# Altium project ld_monitoring_decoupling.PrjPcb
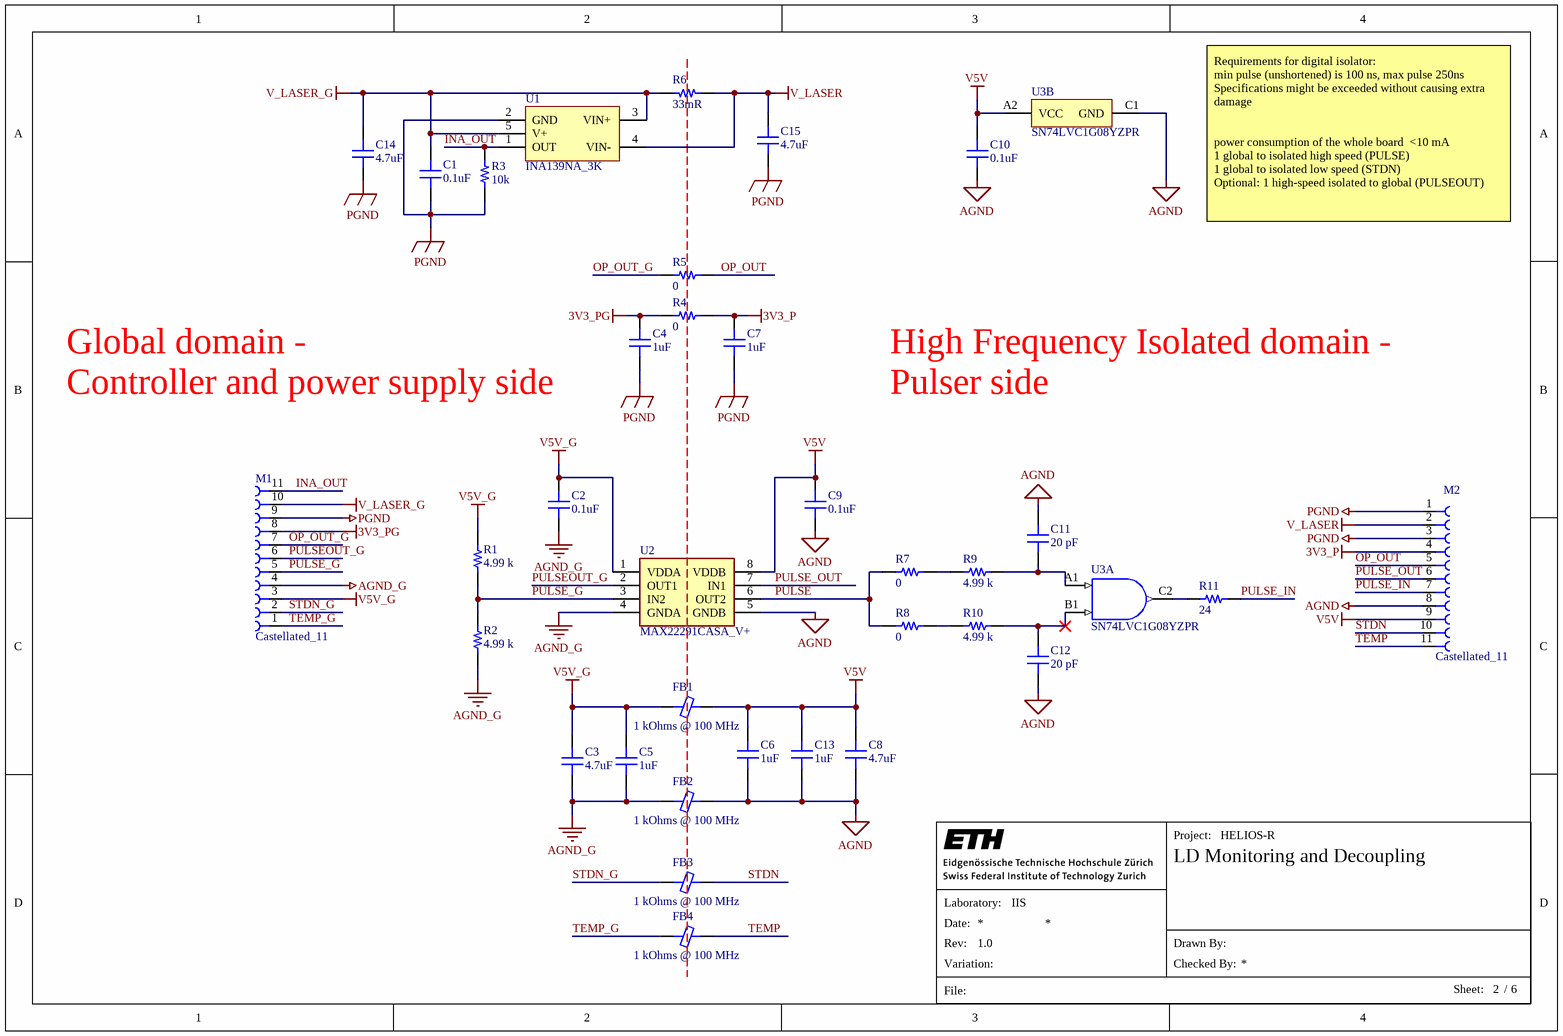
[diagram p0: ld_monitoring_decoupling.SchDoc]
Author: villanif; DrawnBy: =Author; LAB: IIS; Laboratory: =LAB; ProjectTitle: HELIOS-R; Revision: 1.0
1 sheet, 36 parts. Net scope: global (net labels, ports and power ports of the same name join across sheets).
Board files: ld_monitoring_decoupling.PcbDoc, LD_panel_monitoring_module.PcbDoc

## Sheet ld_monitoring_decoupling.SchDoc: LD Monitoring and Decoupling
size A4; Organization: IIS; SheetNumber: 2; SheetTotal: 6; FileInfo: ld_monitoring_decoupling.SchDoc

### Parts
(Parts that share a designator on the sheet are numbered #1, #2 ... from top to bottom, then left to right.)
C1  0.1uF  [CAP 0201_0603]
C2  0.1uF  [CAP 0201_0603]
C3  4.7uF  [CAP 0805_2012]
C4  1uF  [FP-LLL152-0_2-MFG]
C5  1uF  [FP-LLL152-0_2-MFG]
C6  1uF  [FP-LLL152-0_2-MFG]
C7  1uF  [FP-LLL152-0_2-MFG]
C8  4.7uF  [CAP 0805_2012]
C9  0.1uF  [CAP 0201_0603]
C10  0.1uF  [CAP 0201_0603]
C11  20 pF  [CAP 0402_1005]
C12  20 pF  [CAP 0402_1005]
C13  1uF  [FP-LLL152-0_2-MFG]
C14  4.7uF  [CAP 0805_2012]
C15  4.7uF  [CAP 0805_2012]
FB1  1 kOhms @ 100 MHz  [FER 0603_1608]
FB2  1 kOhms @ 100 MHz  [FER 0603_1608]
FB3  1 kOhms @ 100 MHz  [FER 0603_1608]
FB4  1 kOhms @ 100 MHz  [FER 0603_1608]
M1  Castellated_11  [Castellated_]  (no BOM)
M2  Castellated_11  [Castellated_]  (no BOM)
R1  4.99 k  [RES 0402_1005]
R2  4.99 k  [RES 0402_1005]
R3  10k  [RES 0402_1005]
R4  0  [RES 0201_0603]
R5  0  [RES 0201_0603]
R6  33mR  [STACKPOLE CSR0603]
R7  0  [RES 0402_1005]
R8  0  [RES 0402_1005]
R9  4.99 k  [RES 0201_0603]
R10  4.99 k  [RES 0201_0603]
R11  24  [RES 0201_0603]
U1  INA139NA_3K  [SOT95P280X145-5N]
U2  MAX22291CASA_V+  [SOIC127P600X175-8N]
U3#1  SN74LVC1G08YZPR  [YZP0005ADAD]  (part B of 2)
U3#2  SN74LVC1G08YZPR  [YZP0005ADAD]  (part A of 2)

### Nets
3V3_P: C7.2 M2.4 R4.2
3V3_PG: C4.2 M1.8 R4.1
AGND: C6.1 C8.1 C9.1 C10.1 C11.1 C12.1 C13.1 FB2.2 M2.8 U2.5(GNDB) U3#1.C1(GND)
AGND_G: C2.2 C3.1 C5.1 FB2.1 M1.4 R2.1 U2.4(GNDA)
PGND: C1.2 C4.1 C7.1 C14.1 C15.1 M1.9 M2.1 M2.3 R3.1 U1.2(GND)
V5V: C6.2 C8.2 C9.2 C10.2 C13.2 FB1.2 M2.9 U2.8(VDDB) U3#1.A2(VCC)
V5V_G: C2.1 C3.2 C5.2 FB1.1 M1.3 R1.2 U2.1(VDDA)
V_LASER: C15.2 M2.2 R6.1 U1.4(VIN-)
V_LASER_G: C1.1 C14.2 M1.10 R6.2 U1.3(VIN+) U1.5(V+)
INA_OUT: M1.11 R3.2 U1.1(OUT)
OP_OUT: M2.5 R5.2
OP_OUT_G: M1.7 R5.1
PULSE: R7.1 R8.1 U2.6(OUT2)
PULSE_G: M1.5 R1.1 R2.2 U2.3(IN2)
PULSE_IN: M2.7 R11.2
PULSE_OUT: M2.6 U2.7(IN1)
PULSEOUT_G: M1.6 U2.2(OUT1)
STDN: FB3.2 M2.10
STDN_G: FB3.1 M1.2
TEMP: FB4.2 M2.11
TEMP_G: FB4.1 M1.1
NetC11_2: C11.2 R9.2 U3#2.A1(A)
NetC12_2: C12.2 R10.2 U3#2.B1(B)
NetR7_2: R7.2 R9.1
NetR8_2: R8.2 R10.1
NetR11_1: R11.1 U3#2.C2(Y)

### Notes on the sheet
- Requirements for digital isolator:
  min pulse (unshortened) is 100 ns, max pulse 250ns
  Specifications might be exceeded without causing extra damage
  power consumption of the whole board  <10 mA
  1 global to isolated high speed (PULSE)
  1 global to isolated low speed (STDN)
  Optional: 1 high-speed isolated to global (PULSEOUT)
- Global domain -
- High Frequency Isolated domain -
- (near C4) Controller and power supply side
- Pulser side
- Project:
- Laboratory:
- Date:
- File:
- Rev:
- Variation:
- Drawn By:
- Checked By:
- Sheet:
- /

### Library data of the parts
C1 C2 C9 C10 = GRM033R6YA104ME14D: CAP CER 0.1UF 35V X5R 0201; manufacturer: Murata Electronics; Capacitance: 0.1 µF; Tolerance: ±20%; Part Number: GRM033R6YA104ME14D; Applications: General Purpose; componentlink1description: Datasheet; componentlink1url: https://search.murata.co.jp/Ceramy/image/img/A01X/G101/ENG/GRM033R6YA104ME14-01.pdf; componentlink2description: DigiKey Link; componentlink2url: https://www.digikey.com/en/products/detail/murata-electronics/GRM033R6YA104ME14D/5027516; Device Package: 0201 (0603 Metric); lastupdated: 15/07/2023 19:00:56; Lifecycle Status: Active; Minimum Order: 1; Mounting Type: Surface Mount; Operating Temperature: -55°C ~ 85°C; Package / Case: 0201 (0603 Metric); packaging: CutTape; partid: 17; Part Status: Active; price: 0.01; series: GRM; Size / Dimension: 0.024" L x 0.012" W (0.60mm x 0.30mm); Supplier 1: Digi-Key; Supplier Part Number 1: 490-10431-1-ND; Temperature Coefficient: X5R; Thickness (Max): 0.013" (0.33mm); Voltage - Rated: 35V; Value: 0.1uF; Supplier 2: Mouser; Supplier Part Number 2: 81-GRM33R6YA104ME14D
C3 C8 C14 C15 = GRM21BC81H475KE11L: CAP CER 4.7UF 50V X6S 0805; Manufacturer: Murata; Dielectric Material: Ceramic; Tolerance  (fill in as +-): 10%; Multilayer: Yes; Supplier: Mouser; Supplier Part Number: 81-GRM21BC81H475KE1L; Manufacturer Part Number: GRM21BC81H475KE11L; RoHS: Yes; Category: Ceramic Capacitors; Stock: 22290; Pricing: 1=0.29, 10=0.141, 50=0.141, 100=0.091, 1000=0.077, 10000=0.062 (USD); Mounting Technology: Surface Mount; Pins: 2; Case/Package: 0805; Terminal Finish: Nickel; Package Shape: Rectangular; Min Operating Temperature: -55°C; Max Operating Temperature: 105°C; JESD-609 Code: e3; Value: 4.7uF; Capacitor Type: Ceramic; Package Style: SMTMeter; Packaging: Tape and Reel; Tolerance (fill in as +-): 10%; Rated DC Voltage (URdc): 50V; Temperature Characteristics Code: X6S; Termination: Wraparound; Length: 2mm; Width: 1.25mm; Height: 1.25mm; Reach SVHC Compliant: Yes; RoHS Compliant: Yes; ComponentLink1URL: https://datasheet.ciiva.com:443/pdfs/VipMasterIC/IC/MURE/MURE-S-A0004349797/MURE-S-A0004361772-1.pdf?src-supplier=IHS+Markit; ComponentLink1Description: https://datasheet.ciiva.com:443/pdfs/VipMasterIC/IC/MURE/MURE-S-A0004349797/MURE-S-A0004361772-1.pdf?src-supplier=IHS+Markit; ComponentLink2URL: http://www.mouser.com/ds/2/281/c02e-2905.pdf?src-supplier=Mouser; ComponentLink2Description: http://www.mouser.com/ds/2/281/c02e-2905.pdf?src-supplier=Mouser; ComponentLink3URL: http://search.murata.co.jp/Ceramy/image/img/A01X/G101/ENG/GRM21BC81H475KE11-01.pdf?src-supplier=Digi-Key; ComponentLink3Description: http://search.murata.co.jp/Ceramy/image/img/A01X/G101/ENG/GRM21BC81H475KE11-01.pdf?src-supplier=Digi-Key; ComponentLink4URL: https://search.murata.co.jp/Ceramy/image/img/A01X/G101/ENG/GRM21BC81H475KE11-01.pdf?src-supplier=Digi-Key; ComponentLink4Description: https://search.murata.co.jp/Ceramy/image/img/A01X/G101/ENG/GRM21BC81H475KE11-01.pdf?src-supplier=Digi-Key; Supplier 1: Mouser; Supplier Part Number 1: 81-GRM21BC81H475KE1K
C4-C7 C13 = LLL152D70J105ME01D: CAP LOW L CER 1UF 6.3V X7T 0204; Manufacturer: Murata; Manufacturer Part Number: LLL152D70J105ME01D; Supplier: Mouser; Supplier Part Number: 81-LLL152D70J105ME01; RoHS: No; Category: Ceramic Capacitors; Stock: 241363; Pricing: 1=0.32, 10=0.173, 50=0.173, 100=0.104, 1000=0.08, 10000=0.06 (USD); Supplier 1: Mouser; Supplier Part Number 1: 81-LLL152D70J105ME01
C11 C12 = GCM1555C1H200FA16D: CAP CER 20PF 50V C0G/NP0 0402; manufacturer: Murata Electronics; Temperature Coefficient: C0G, NP0; Tolerance: ±1%; Part Number: GCM1555C1H200FA16D; Applications: Automotive; Capacitance: 20 pF; componentlink1description: Datasheet; componentlink1url: https://search.murata.co.jp/Ceramy/image/img/A01X/G101/ENG/GCM1555C1H200FA16-01.pdf; componentlink2description: DigiKey Link; componentlink2url: https://www.digikey.com/en/products/detail/murata-electronics/GCM1555C1H200FA16D/13401847; Device Package: 0402 (1005 Metric); lastupdated: 15/07/2023 19:03:20; Lifecycle Status: Active; Minimum Order: 1; Mounting Type: Surface Mount, MLCC; Operating Temperature: -55°C ~ 125°C; Package / Case: 0402 (1005 Metric); packaging: TapeAndReel; partid: 45712; Part Status: Active; price: 0.01; Ratings: AEC-Q200; series: GCM; Size / Dimension: 0.039" L x 0.020" W (1.00mm x 0.50mm); Supplier 1: Digi-Key; Supplier Part Number 1: 490-GCM1555C1H200FA16DCT-ND; Thickness (Max): 0.022" (0.55mm); Voltage - Rated: 50V; Value: 20 pF; Supplier 2: Mouser; Supplier Part Number 2: 81-GCM1555C1H200FA6D
FB1-FB4 = BLM18SP102SH1D: FERRITE BEAD 1K OHM 0603 1LN; Manufacturer: Murata Electronics; Current Rating (Max): 1.2A; DC Resistance (DCR) (Max): 185mOhm; Filter Type: Power Line; Number of Lines: 1; Part Number: BLM18SP102SH1D; ComponentLink1Description: Datasheet; ComponentLink1URL: https://www.murata.com/products/productdata/8796737273886/QNFA9101.pdf; ComponentLink2Description: DigiKey Link; ComponentLink2URL: https://www.digikey.com/en/products/detail/murata-electronics/BLM18SP102SH1D/12759403; Device Package: 0603 (1608 Metric); Height (Max): 0.037" (0.95mm); Impedance @ Frequency: 1 kOhms @ 100 MHz; LastUpdated: 13/07/2023 19:55:34; Lifecycle Status: Active; Minimum Order: 1; Mounting Type: Surface Mount; Operating Temperature: -55°C ~ 125°C; Package / Case: 0603 (1608 Metric); Packaging: TapeAndReel; PartId: 2122; Part Status: Active; Price: 0.05; Ratings: AEC-Q200; Series: BLM; Size / Dimension: 0.063" L x 0.031" W (1.60mm x 0.80mm); Value: 1 kOhms @ 100 MHz; Supplier 1: Digi-Key; Supplier Part Number 1: 490-BLM18SP102SH1DCT-ND; Supplier 2: Mouser; Supplier Part Number 2: 81-BLM18SP102SH1D
M1 M2 = Castellated_11: Castellated holes, 11 pin, 0.6 mm hole diameter, 1.27 mm pitch
R1 R2 = ERA-2AEB4991X: RES SMD 4.99KOHM 0.1% 1/16W 0402; Manufacturer: Panasonic Electronic Components; Power (Watts): 0.063W, 1/16W; Resistance: 4.99 kOhms; Temperature Coefficient: ±25ppm/°C; Part Number: ERA-2AEB4991X; ComponentLink1Description: Datasheet; ComponentLink1URL: https://industrial.panasonic.com/cdbs/www-data/pdf/RDM0000/AOA0000C307.pdf; ComponentLink2Description: DigiKey Link; ComponentLink2URL: https://www.digikey.com/en/products/detail/panasonic-electronic-components/ERA-2AEB4991X/2026116; Composition: Thin Film; Device Package: 0402 (1005 Metric); Features: Automotive AEC-Q200; Height - Seated (Max): 0.016" (0.40mm); LastUpdated: 13/07/2023 19:22:52; Lifecycle Status: Active; Minimum Order: 1; Number of Terminations: 2; Operating Temperature: -55°C ~ 155°C; Package / Case: 0402 (1005 Metric); Packaging: TapeAndReel; PartId: 6112; Part Status: Active; Price: 0.04; Ratings: AEC-Q200; Series: ERA-2A; Size / Dimension: 0.039" L x 0.020" W (1.00mm x 0.50mm); Supplier 1: Digi-Key; Supplier Part Number 1: 10-ERA-2AEB4991XCT-ND; Supplier Device Package: 0402; Tolerance: ±0.1%; Value: 4.99 k; Supplier 2: Mouser; Supplier Part Number 2: 667-ERA-2AEB4991X
R3 = ERJ-1GNF1002C: RES SMD 10KOHM 0.1% 63mW 0402; Manufacturer: Panasonic; Manufacturer Part Number: ERA-2AEB103X; Rated Temperature: 85°C; Temperature Coefficient: 25ppm/°C; Working Voltage: 25V; Package Height: 0.35mm; Package Length: 1mm; Package Width: 0.5mm; Reference Standard: AEC-Q200; Supplier 1: Mouser; RoHS: Yes; Category: Chip SMD Resistors; Stock 1: 679779; Pricing 1: 1=0.39, 10=0.153, 50=0.153, 100=0.077, 1000=0.056, 10000=0.051 (USD); Mounting Technology: Surface Mount; Pins: 2; Case/Package: 0402; Terminal Finish: Nickel; Min Operating Temperature: -55°C; Max Operating Temperature: 155°C; Tolerance: 0.1%; JESD-609 Code: e3; Resistor Type: FIXED RESISTOR; Construction: Rectangular; Package Style: SMTMeter; Packaging: Tape and Reel; Power: 63mW; Value: 10k; Technology: THIN FILM; Termination: Wraparound; Reach SVHC Compliant: Yes; RoHS Compliant: Yes; ComponentLink1URL: https://datasheet.ciiva.com:443/pdfs/VipMasterIC/IC/PANA/PANA-S-A0009459258/PANA-S-A0009459258-1.pdf?src-supplier=IHS+Markit; ComponentLink1Description: https://datasheet.ciiva.com:443/pdfs/VipMasterIC/IC/PANA/PANA-S-A0009459258/PANA-S-A0009459258-1.pdf?src-supplier=IHS+Markit; ComponentLink2URL: https://datasheet.ciiva.com/46398/328837-46398998.pdf?src-supplier=Element14; ComponentLink2Description: https://datasheet.ciiva.com/46398/328837-46398998.pdf?src-supplier=Element14; ComponentLink3URL: https://datasheet.ciiva.com/5838/328837-5838011.pdf?src-supplier=Farnell; ComponentLink3Description: https://datasheet.ciiva.com/5838/328837-5838011.pdf?src-supplier=Farnell; ComponentLink4URL: https://datasheet.ciiva.com/9116/aoa0000ce26-9116649.pdf?src-supplier=Avnet; ComponentLink4Description: https://datasheet.ciiva.com/9116/aoa0000ce26-9116649.pdf?src-supplier=Avnet; ComponentLink5URL: https://datasheet.ciiva.com/30213/54aoa0000ce26-30213096.pdf?src-supplier=Onlinecomponents.com; ComponentLink5Description: https://datasheet.ciiva.com/30213/54aoa0000ce26-30213096.pdf?src-supplier=Onlinecomponents.com; Supplier Part Number 1: 667-ERA-2AEB103X
R4 R5 = ERJ-1GN0R00C: RES SMD 0OHM 0.1% 1/20W 0201; Manufacturer: Panasonic; Power: 50mW; Rated Temperature: 70°C; Package Height: 0.23mm; Package Length: 0.6mm; Package Width: 0.3mm; Reference Standard: AEC-Q200; Supplier: Mouser; Supplier Part Number: 667-ERJ-1GN0R00C; Manufacturer Part Number: ERJ-1GN0R00C; RoHS: Yes; Category: Chip SMD Resistors; Stock: 4285208; Pricing: 1=0.1, 10=0.018, 50=0.018, 100=0.008, 1000=0.006, 10000=0.004 (USD); Mounting Technology: Surface Mount; Pins: 2; Package Shape: Rectangular; Case/Package: 0201; Terminal Finish: Nickel; Min Operating Temperature: -55°C; Max Operating Temperature: 125°C; JESD-609 Code: e3; Resistor Type: FIXED RESISTOR; Construction: Rectangular; Package Style: SMTMeter; Packaging: Tape and Reel; Value: 0; Technology: METAL GLAZE/THICK FILM; Termination: Wraparound; Reach SVHC Compliant: Yes; RoHS Compliant: Yes; ComponentLink1URL: https://datasheet.ciiva.com:443/pdfs/VipMasterIC/IC/PANA/PANA-S-A0009459603/PANA-S-A0009459603-1.pdf?src-supplier=IHS+Markit; ComponentLink1Description: https://datasheet.ciiva.com:443/pdfs/VipMasterIC/IC/PANA/PANA-S-A0009459603/PANA-S-A0009459603-1.pdf?src-supplier=IHS+Markit; Supplier 1: Mouser; Supplier Part Number 1: 667-ERJ-1GN0R00C
R6 = RL0816T-R033-F: RES 0.033 OHM 1% 1/4W 0603; Manufacturer: Susumu; Description: Fixed Resistor, Thin Film, 0.25W, 0.033ohm, 0.0908V, 1% +/-Tol, 0,350ppm/Cel, Surface Mount, 0603; Power: 250mW; Rated Temperature: 70°C; Temperature Coefficient (ppm/Cel): 350; Package Height: 0.45mm; Package Length: 1.6mm; Package Width: 0.8mm; Supplier 1: Mouser; Manufacturer Part Number: RL0816T-R033-F; RoHS: Yes; Category: Chip SMD Resistors; Stock 1: 9602; Pricing 1: 1=0.3, 10=0.192, 50=0.144, 100=0.128, 1000=0.082, 10000=0.06 (USD); Mounting Technology: Surface Mount; Pins: 2; Package Shape: Rectangular; Case/Package: 0603; Terminal Finish: Tin; Min Operating Temperature: -55°C; Max Operating Temperature: 125°C; Tolerance: 1%; JESD-609 Code: e3; Resistor Type: FIXED RESISTOR; Construction: Chip; Value: 33mR; Technology: THIN FILM; Termination: Wraparound; Reach SVHC Compliant: Yes; RoHS Compliant: Yes; ComponentLink1URL: https://datasheet.ciiva.com:443/pdfs/VipMasterIC/IC/SUSU/SUSU-S-A0004662802/SUSU-S-A0004662802-1.pdf?src-supplier=IHS+Markit; ComponentLink1Description: https://datasheet.ciiva.com:443/pdfs/VipMasterIC/IC/SUSU/SUSU-S-A0004662802/SUSU-S-A0004662802-1.pdf?src-supplier=IHS+Markit; ComponentLink2URL: https://datasheet.ciiva.com/2502/e-15-16-2502058.pdf?src-supplier=Digikey; ComponentLink2Description: https://datasheet.ciiva.com/2502/e-15-16-2502058.pdf?src-supplier=Digikey; ComponentLink3URL: https://datasheet.ciiva.com/2502/e-15-16-2502059.pdf?src-supplier=Digikey; ComponentLink3Description: https://datasheet.ciiva.com/2502/e-15-16-2502059.pdf?src-supplier=Digikey; ComponentLink4URL: https://datasheet.ciiva.com/12915/e-15-16-12915349.pdf?src-supplier=Mouser; ComponentLink4Description: https://datasheet.ciiva.com/12915/e-15-16-12915349.pdf?src-supplier=Mouser; ComponentLink5URL: https://datasheet.ciiva.com/2502/rl-data-sheet-2502057.pdf?src-supplier=Digikey; ComponentLink5Description: https://datasheet.ciiva.com/2502/rl-data-sheet-2502057.pdf?src-supplier=Digikey
R7 R8 = ERJ-S020R00X: RES SMD 0OHM 1/10W 0402; Manufacturer: Panasonic; Power: 100mW; Rated Temperature: 70°C; Package Height: 0.35mm; Package Length: 1mm; Package Width: 0.5mm; Reference Standard: IEC; Supplier 1: Mouser; Manufacturer Part Number: ERJ-S020R00X; RoHS: Yes; Category: Chip SMD Resistors; Stock 1: 388028; Pricing 1: 1=0.25, 10=0.09, 50=0.09, 100=0.057, 1000=0.041, 10000=0.031 (USD); Mounting Technology: Surface Mount; Pins: 2; Case/Package: 0402; Terminal Finish: Tin; Package Shape: Rectangular; Min Operating Temperature: -55°C; Max Operating Temperature: 155°C; JESD-609 Code: e3; Resistor Type: FIXED RESISTOR; Construction: Rectangular; Package Style: SMTMeter; Packaging: Tape and Reel; Value: 0; Technology: METAL GLAZE/THICK FILM; Termination: Wraparound; Reach SVHC Compliant: Yes; RoHS Compliant: Yes; ComponentLink1URL: https://datasheet.ciiva.com:443/pdfs/VipMasterIC/IC/PANA/PANA-S-A0008969865/PANA-S-A0008969865-1.pdf?src-supplier=IHS+Markit; ComponentLink1Description: https://datasheet.ciiva.com:443/pdfs/VipMasterIC/IC/PANA/PANA-S-A0008969865/PANA-S-A0008969865-1.pdf?src-supplier=IHS+Markit; ComponentLink2URL: https://datasheet.ciiva.com/24051/aoa0000ce5-24051112.pdf?src-supplier=Mouser; ComponentLink2Description: https://datasheet.ciiva.com/24051/aoa0000ce5-24051112.pdf?src-supplier=Mouser; Supplier Part Number 1: 667-ERJ-S020R00X
R9 R10 = ERJ-1GNF4991C: RES SMD 4.99 kOHM 1% 1/20W 0201; Manufacturer: Panasonic; Supplier: Mouser; Supplier Part Number: 667-ERJ-1GNF4991C; Manufacturer Part Number: ERJ-1GNF4991C; RoHS: Yes; Category: Chip SMD Resistors; Stock: 73903; Pricing: 1=0.1, 10=0.033, 50=0.033, 100=0.015, 1000=0.011, 10000=0.007 (USD); ComponentLink1URL: https://datasheet.ciiva.com/24210/aoa0000ce2-24210761.pdf?src-supplier=Mouser; ComponentLink1Description: https://datasheet.ciiva.com/24210/aoa0000ce2-24210761.pdf?src-supplier=Mouser; Supplier 1: Mouser; Supplier Part Number 1: 667-ERJ-1GNF4991C; Value: 4.99 k
R11 = ERJ-1GNF24R0C: RES SMD 24 OHM 1% 1/20W 0201; Manufacturer: Panasonic; Power: 50mW; Rated Temperature: 70°C; Temperature Coefficient: 200ppm/°C; Working Voltage: 25V; Package Height: 0.23mm; Package Length: 0.6mm; Package Width: 0.3mm; Reference Standard: AEC-Q200; Supplier 1: Mouser; Manufacturer Part Number: ERJ-1GNF24R0C; RoHS: Yes; Category: Chip SMD Resistors; Stock 1: 78378; Pricing 1: 1=0.1, 10=0.023, 50=0.023, 100=0.014, 1000=0.01, 10000=0.007 (USD); Mounting Technology: Surface Mount; Pins: 2; Package Shape: Rectangular; Case/Package: 0201; Terminal Finish: Nickel; Min Operating Temperature: -55°C; Max Operating Temperature: 125°C; Tolerance: 1%; JESD-609 Code: e3; Resistor Type: FIXED RESISTOR; Construction: Rectangular; Package Style: SMTMeter; Packaging: Tape and Reel; Value: 24; Technology: METAL GLAZE/THICK FILM; Termination: Wraparound; Reach SVHC Compliant: Yes; RoHS Compliant: Yes; ComponentLink1URL: https://datasheet.ciiva.com:443/pdfs/VipMasterIC/IC/PANA/PANA-S-A0009889626/PANA-S-A0009889626-1.pdf?src-supplier=IHS+Markit; ComponentLink1Description: https://datasheet.ciiva.com:443/pdfs/VipMasterIC/IC/PANA/PANA-S-A0009889626/PANA-S-A0009889626-1.pdf?src-supplier=IHS+Markit; ComponentLink2URL: https://datasheet.ciiva.com/46440/1678782-46440365.pdf?src-supplier=Element14; ComponentLink2Description: https://datasheet.ciiva.com/46440/1678782-46440365.pdf?src-supplier=Element14; ComponentLink3URL: https://datasheet.ciiva.com/7861/aoa0000ce2-7861836.pdf?src-supplier=Element14; ComponentLink3Description: https://datasheet.ciiva.com/7861/aoa0000ce2-7861836.pdf?src-supplier=Element14; ComponentLink4URL: https://datasheet.ciiva.com/43467/1678782-43467015.pdf?src-supplier=Farnell; ComponentLink4Description: https://datasheet.ciiva.com/43467/1678782-43467015.pdf?src-supplier=Farnell; Supplier Part Number 1: 667-ERJ-1GNF24R0C
U1 = INA139NA_3K: IC Inamp high-side current monitor; Manufacturer: Texas Instruments; Manufacturer Part Number: INA139NA/3K; Amplifier Type: INSTRUMENTATION AMPLIFIER; Average Bias Current-Max (IIB): 10uA; Bandwidth (3dB)-Nom: 440kHz; Channels: 1; Common Mode Rejection Ratio-Min: 100dB; Input Offset Voltage-Max: 1mV; Nominal Supply Voltage: 5V; Non-linearity-Max: 0.1%; Package Body Material: Plastic; Package Equivalence Code: TSSOP14,.25; Qualification Status: Not Qualified; Supply Voltage Limit-Max: 60V; Voltage Gain-Max: 100; Case/Package: LSSOP; Category: Amplifiers - Op Amps, Buffer, Instrumentation; ComponentLink1Description: https://www.ti.com:443/lit/ds/symlink/ina139.pdf?src-supplier=IHS+Markit; ComponentLink1URL: https://www.ti.com:443/lit/ds/symlink/ina139.pdf?src-supplier=IHS+Markit; ComponentLink2Description: https://datasheet.ciiva.com/15128/getdatasheetpartid-248784-15128606.pdf?src-supplier=Verical; ComponentLink2URL: https://datasheet.ciiva.com/15128/getdatasheetpartid-248784-15128606.pdf?src-supplier=Verical; ComponentLink3Description: https://datasheet.ciiva.com/1939/ina139-1939993.pdf?src-supplier=Digi-Key; ComponentLink3URL: https://datasheet.ciiva.com/1939/ina139-1939993.pdf?src-supplier=Digi-Key; ComponentLink4Description: https://datasheet.ciiva.com/2976/ina169-2976115.pdf?src-supplier=Avnet; ComponentLink4URL: https://datasheet.ciiva.com/2976/ina169-2976115.pdf?src-supplier=Avnet; ComponentLink5Description: https://datasheet.ciiva.com/1939/ina139-1939992.pdf?src-supplier=Digi-Key; ComponentLink5URL: https://datasheet.ciiva.com/1939/ina139-1939992.pdf?src-supplier=Digi-Key; ComponentLink6Description: https://datasheet.ciiva.com/1939/ina139-1939994.pdf?src-supplier=Digi-Key; ComponentLink6URL: https://datasheet.ciiva.com/1939/ina139-1939994.pdf?src-supplier=Digi-Key; Height - Seated (Max): 1.45mm; JESD-30 Code: R-PDSO-G5; JESD-609 Code: e4; Length: 2.9mm; Max Operating Temperature: 125°C; Min Operating Temperature: -40°C; Moisture Sensitivity Level: 2; Package Shape: Rectangular; Package Style: SMALL OUTLINE, LOW PROFILE, SHRINK PITCHMeter; Packaging: Tape and Reel; Peak Reflow Temperature (Cel): 260°C; Pins: 5; Pricing 1: 1=1.5, 10=1.27, 50=1.27, 100=1.02, 1000=0.737, 10000=0.736 (USD); Reach SVHC Compliant: Yes; RoHS: Yes; RoHS Compliant: Yes; Stock 1: 21999; Supplier 1: Mouser; Supplier Part Number 1: 595-INA139NA/3K; Surface Mount: Yes; Temperature Grade: AUTOMOTIVE; Terminal Finish: Nickel; Terminal Form: Gull Wing; Terminal Pitch: 0.95mm; Terminal Position: DUAL; Voltage Gain-Min: 1; Width: 1.6mm
U2 = MAX22291CASA_V+: IC Digital Isolator, 2CH; Manufacturer: Maxim; Manufacturer Part Number: MAX22291CASA/V+; Category: Uncategorized; Pricing 1: 1=3.43, 10=2.91, 50=2.91, 100=2.52, 1000=1.85, 10000=1.71 (USD); RoHS: No; Stock 1: 7613; Supplier 1: Mouser; Supplier Part Number 1: 700-MAX22291CASA/V+
U3#1 U3#2 = SN74LVC1G08YZPR: IC Single 2-Input Positive-AND Gate, YZP0005ADAD, LARGE T&R; Manufacturer: Texas Instruments; Voltage(Nom)(V): 1.8,2.5,3.3,5; VCC(Min)(V): 1.65; Bits(#): 1; VCC(Max)(V): 5.5; ICC @ Nom Voltage(Max)(mA): 0.01; Input Type: CMOS/TTL; Output Type: CMOS; 3-State Output: No; Output Drive (IOL/IOH)(Max)(mA): 32/-32; Logic: True; Gate Type: AND; F @ Nom Voltage(Max)(Mhz): 150; tpd @ Nom Voltage(Max)(ns): 4.5,6,4,5; Technology Family: LVC; Rating: Catalog; Sub-Family: AND Gate; Operating Temperature Range(C): -40 to 125,-40 to 85; PackageReference: YZP0005ADAD; Schmitt Trigger: No; Generic Part Number: SN74LVC1G08; DatasheetVersion: SCES217Y; Manufacturer Part Number: SN74LVC1G08YZPR; Supplier 1: Mouser; Supplier Part Number 1: 595-SN74LVC1G08YZPR

## Assembly variants
Fabrication: all parts fitted